# Altium schematic sheet Labrador.SchDoc
size A
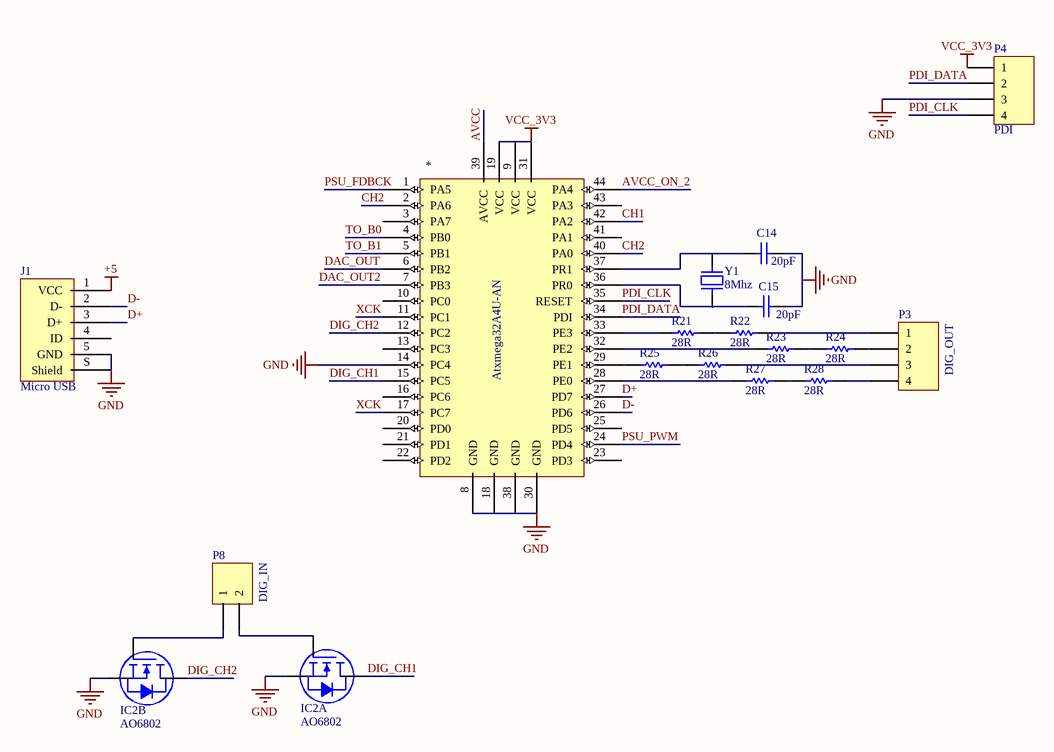
[diagram p0: Labrador.SchDoc]

## Parts
*  Atxmega32A4U-AN  [QFP44P80_1200X1200X120L60X37N]
C14  20pF  [CAPC200X125X75L45N]
C15  20pF  [CAPC200X125X75L45N]
IC2  AO6802  [ALPHAOMEGA TSOP-6]  (parts A,B of 2)
J1  Micro USB  [FCI USB 10118193-0001LF]
P3  DIG_OUT  [HDR1X4]
P4  PDI  [HDR1X4]
P8  DIG_IN  [HDR1X2]
R21  28R  [RESC160X80X55L25N]
R22  28R  [RESC160X80X55L25N]
R23  28R  [RESC160X80X55L25N]
R24  28R  [RESC160X80X55L25N]
R25  28R  [RESC160X80X55L25N]
R26  28R  [RESC160X80X55L25N]
R27  28R  [RESC160X80X55L25N]
R28  28R  [RESC160X80X55L25N]
Y1  8Mhz  [TXC 9C]

## Nets
+5: J1.1(VCC)
GND: *.8(GND) *.14(PC4) *.18(GND) *.30(GND) *.38(GND) C14.2 C15.2 IC2.2(S2) IC2.5(S1) J1.5(GND) J1.S(Shield) P4.3
VCC_3V3: *.9(VCC) *.19(VCC) *.31(VCC) P4.1
AVCC: *.39(AVCC)
AVCC_ON_2: *.44(PA4)
CH1: *.42(PA2)
CH2: *.2(PA6) *.40(PA0)
D+: *.27(PD7) J1.3(D+)
D-: *.26(PD6) J1.2(D-)
DAC_OUT: *.6(PB2)
DAC_OUT2: *.7(PB3)
DIG_CH1: *.15(PC5) IC2.6(D1)
DIG_CH2: *.12(PC2) IC2.4(D2)
PDI_CLK: *.35(RESET) P4.4
PDI_DATA: *.34(PDI) P4.2
PSU_FDBCK: *.1(PA5)
PSU_PWM: *.24(PD4)
TO_B0: *.4(PB0)
TO_B1: *.5(PB1)
XCK: *.11(PC1) *.17(PC7)
Net*_28: *.28(PE0) R27.1
Net*_29: *.29(PE1) R25.1
Net*_32: *.32(PE2) R23.1
Net*_33: *.33(PE3) R21.1
Net*_36: *.36(PR0) C15.1 Y1.1
Net*_37: *.37(PR1) C14.1 Y1.2
NetIC2_1: IC2.1(G1) P8.2
NetIC2_3: IC2.3(G2) P8.1
NetP3_1: P3.1 R22.2
NetP3_2: P3.2 R24.2
NetP3_3: P3.3 R26.2
NetP3_4: P3.4 R28.2
NetR21_2: R21.2 R22.1
NetR23_2: R23.2 R24.1
NetR25_2: R25.2 R26.1
NetR27_2: R27.2 R28.1

Not connected (* = marked no-connect by the designer): * 3(PA7) 10(PC0) 13(PC3) 16(PC6) 20(PD0) 21(PD1) 22(PD2) 23(PD3) 25(PD5) 41(PA1) 43(PA3); J1 4(ID)

## Library data of the parts
C14 C15 = CL21C180JBANNNC: CAP CER 20PF 50V NP0 0805; Manufacturer: Samsung Electro-Mechanics America, Inc.; Capacitance: 18pF; Tolerance: ±5%; Temperature Coefficient: C0G, NP0; Supplier 1: Digi-Key; Manufacturer Part Number: CL21C180JBANNNC; RoHS: RoHS Compliant; Category: Capacitors; Stock 1: 151885; Pricing 1: 1=0.1, 10=0.044, 25=0.032, 50=0.024, 100=0.0196, 250=0.0164, 500=0.014, 1000=0.011 (USD); Packaging: Digi-Reel®; Part Status: Active; Voltage - Rated: 50V; Operating Temperature: -55°C ~ 125°C; Features: -; Ratings: -; Applications: General Purpose; Mounting Type: Surface Mount, MLCC; Package / Case: 0805 (2012 Metric); Size / Dimension: 0.079" L x 0.049" W (2.00mm x 1.25mm); Height - Seated (Max): -; Thickness (Max): 0.030" (0.75mm); Lead Spacing: -; Lead Style: -; ComponentLink1URL: http://www.samsungsem.com/kr/support/product-search/mlcc/__icsFiles/afieldfile/2016/08/18/S_CL21C180JBANNNC.pdf; ComponentLink1Description: http://www.samsungsem.com/kr/support/product-search/mlcc/__icsFiles/afieldfile/2016/08/18/S_CL21C180JBANNNC.pdf; Supplier Part Number 1: 1276-1107-6-ND
IC2 = ALPHAOMEGA TSOP-6: MOSFET 2N-CH 30V 3.5A 6-TSOP; Manufacturer: Alpha & Omega; Rds On (Max) at Id, Vgs: 50 mOhm @ 3.5A, 10V; Vgs(th) (Max) at Id: 2.5V @ 250µA; Gate Charge (Qg): 5nC @ 10V; Input Capacitance (Ciss) at Vds: 210pF @ 15V; Power - Max: 1.15W; Part Number: AO6802; PartId: 9696; Supplier 1: Digi-Key; Supplier Part Number 1: 785-1082-1-ND; ComponentLink1Description: Datasheet; ComponentLink1URL: http://aosmd.com/res/data_sheets/AO6802.pdf; ComponentLink2Description: Digi-Key Listing; ComponentLink2URL: https://www.digikey.com/product-detail/en/alpha-omega-semiconductor-inc/AO6802/785-1082-1-ND/1856025; Price: 0.17; Type: 2 N-Channel (Dual); Device Package: SC-74, SOT-457; Drain to Source Voltage (Vdss): 30V; Features: Logic Level Gate; Current Continuous Drain: 3.5A
J1 = USB 2.0 Type B Micro: CONN USB MICRO B RECPT SMT R/A; Part Number: 10118193-0001LF; Manufacturer: FCI; Number Of Positions: 5; PartId: 7864; Supplier 1: Digi-Key; Supplier Part Number 1: 609-4616-2-ND; ComponentLink1Description: Datasheet; ComponentLink1URL: http://portal.fciconnect.com/Comergent//fci/drawing/10118193.pdf; ComponentLink2Description: Digi-Key Listing; ComponentLink2URL: http://www.digikey.ca/product-detail/en/10118193-0001LF/609-4616-2-ND/2785388; Price: 0.2823; Type: USB - micro B; Series: USB 2.0
P3 P4 = Header 4: Header, 4-Pin; LatestRevisionDate: 17-Jul-2002; LatestRevisionNote: Re-released for DXP Platform.; Publisher: Altium Limited
P8 = Header 2: Header, 2-Pin; LatestRevisionDate: 17-Jul-2002; LatestRevisionNote: Re-released for DXP Platform.; Publisher: Altium Limited
R21-R28 = RC0603FR-0728RL: RES SMD 28 OHM 1% 1/10W 0603; Manufacturer: Yageo; Temperature Coefficient: 100ppm/°C; Power Rating: 100mW; Voltage Rating: 50V; Supplier 1: Future Electronics; Manufacturer Part Number: RC0603FR-0728RL; Stock 1: 0; Case/Package: 0603; Contact Plating: Matte,Tin; Case Code (Metric): 1608; Case Code (Imperial): 0603; Min Operating Temperature: -55°C; Max Operating Temperature: 155°C; Resistance: 28R; Tolerance: 1%; Composition: Thick Film; Package Quantity: 1; Packaging: Tape and Reel; Number of Terminations: 2; Termination: SMD/SMT; Military Standard: Not; Max Power Dissipation: 100mW; Voltage Rating (DC): 50V; Features: Moisture Resistant; Length: 0.063inch; Height: 0.022inch; Width: 0.031inch; Depth: 0.8mm; Lead Free: Lead Free; ComponentLink1URL: http://www.yageo.com/documents/recent/PYu-RC_Group_51_RoHS_L_9.pdf; ComponentLink1Description: http://www.yageo.com/documents/recent/PYu-RC_Group_51_RoHS_L_9.pdf; ComponentLink2URL: http://www.yageo.com/documents/recent/PYu-RC0603_51_RoHS_L_4.pdf; ComponentLink2Description: http://www.yageo.com/documents/recent/PYu-RC0603_51_RoHS_L_4.pdf
Y1 = ATS08ASM-1: Crystals 8MHz 20pF; Manufacturer: CTS; Frequency Tolerance: 30ppm; ESR (Equivalent Series Resistance): 60R; Frequency Stability: 50ppm; Supplier 1: Future Electronics; Manufacturer Part Number: ATS08ASM-1; Stock 1: 0; Mount: Surface Mount; Min Operating Temperature: -20°C; Max Operating Temperature: 70°C; Frequency: 8MHz; Load Capacitance: 20pF; Packaging: Tape and Reel; Series Resistance: 60R; Package Quantity: 1000; Tolerance: 30ppm; Termination: SMD/SMT; Length: 0.437inch; Height: 0.169inch; Width: 4.83mm; Radiation Hardening: No; Lead Free: Lead Free; ComponentLink1URL: http://www.ctscorp.com/wp-content/uploads/ATS-ATSSM.pdf; ComponentLink1Description: http://www.ctscorp.com/wp-content/uploads/ATS-ATSSM.pdf; ComponentLink2URL: https://www.ctscorp.com/wp-content/uploads/ATS-ATSSM.pdf; ComponentLink2Description: https://www.ctscorp.com/wp-content/uploads/ATS-ATSSM.pdf